# EAGLE design fz10_pow (EAGLE 6.3)
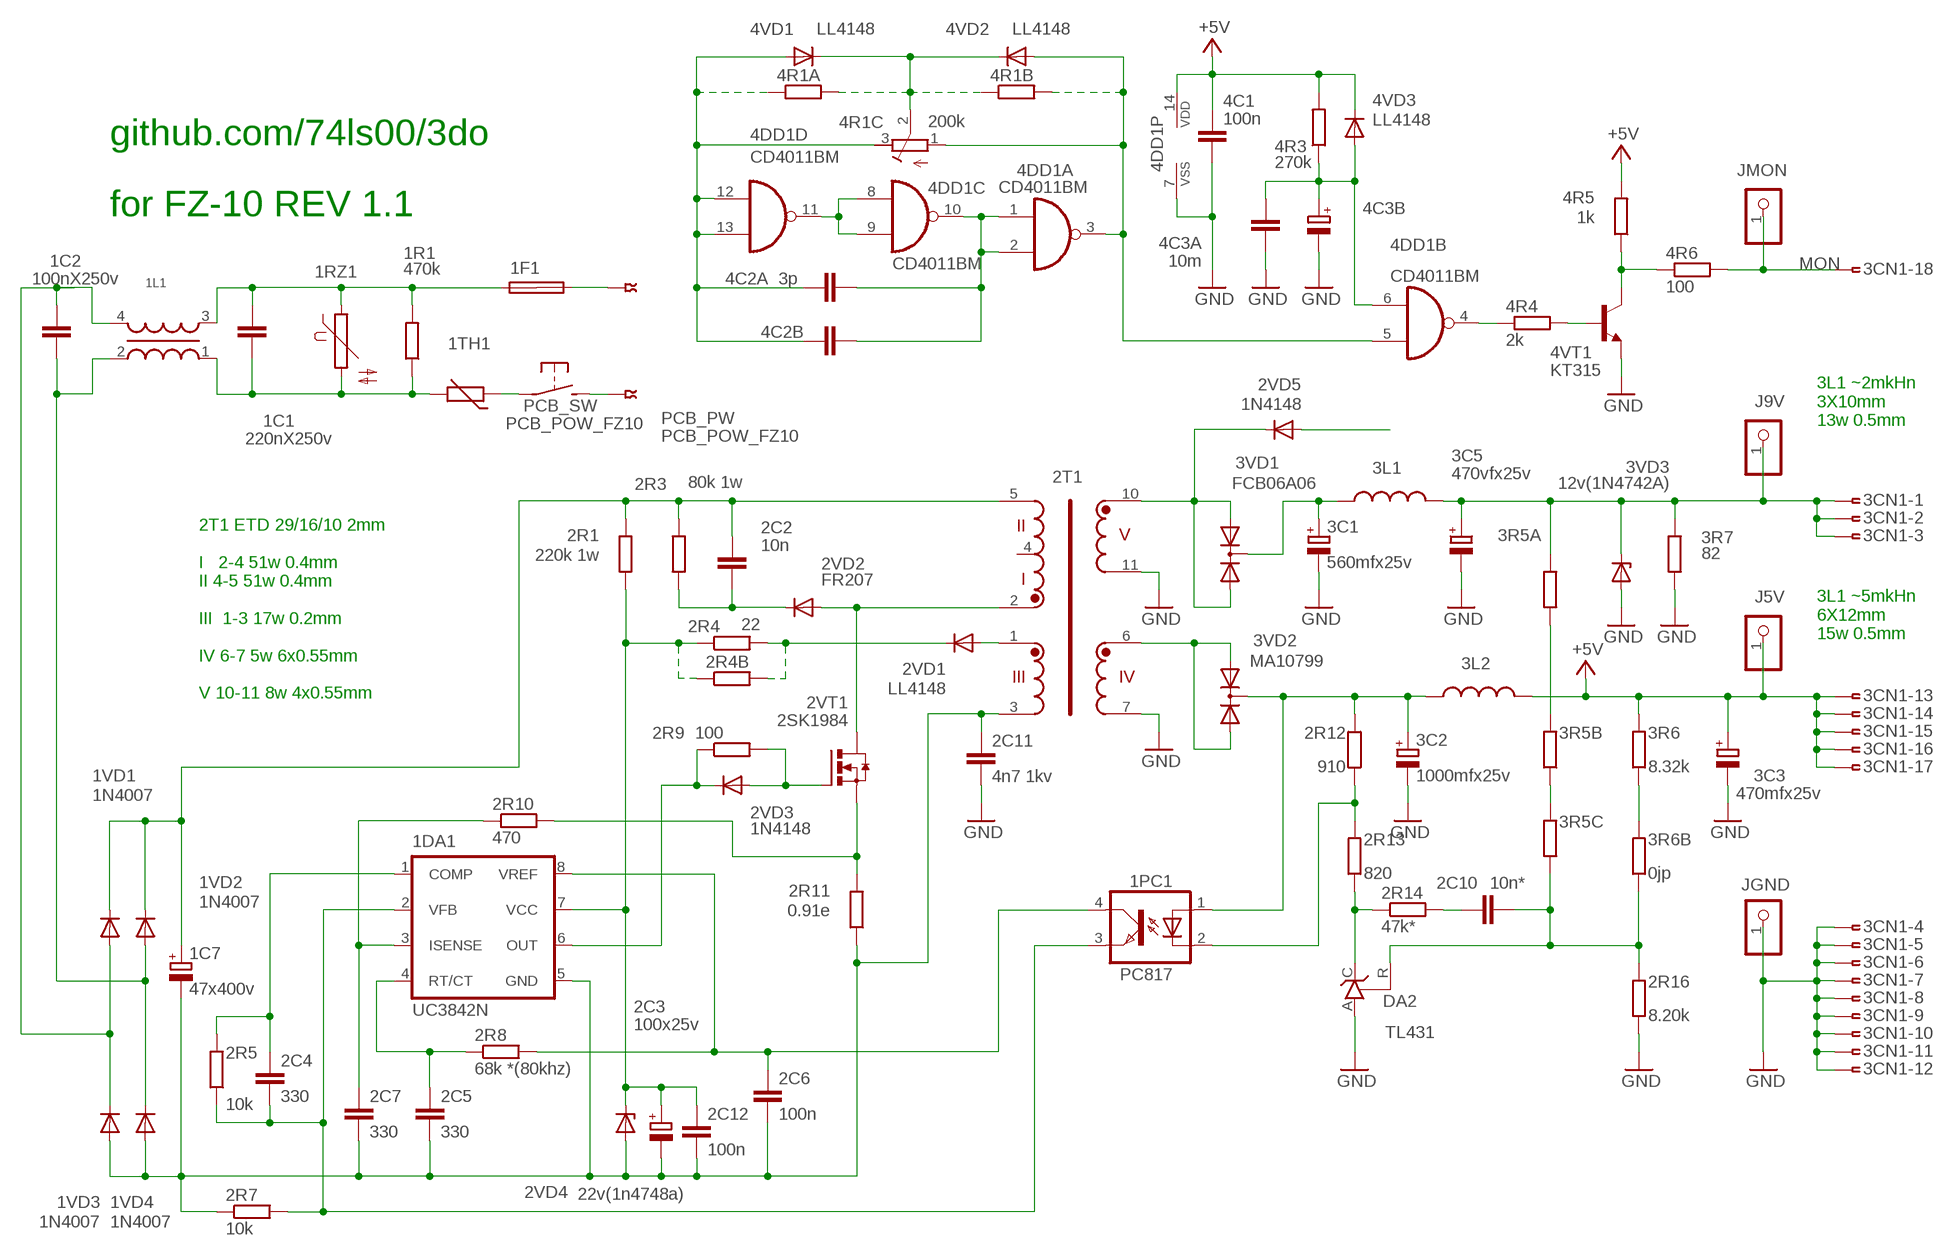
[diagram p0: schematic, sheet 1]

## Parts
1C1  220nX250v  C26X9  [C_26X9]
1C2  100nX250v  C-EU150-084X183  [C150-084X183]
1C7  47x400v  CPOL-EUE10-22.5  [EB22,5D]
1DA1  UC3842N  [DIL08]
1F1  SHK20L  [SHK20L]
1L1  LFLF-10X13  [LF-10X13]
1PC1  PC817  [DIL04]
1R1  470k  R-EU_0309/12  [0309/12]
1RZ1  S1210  [S1210]
1TH1  THERMISTOR-7,5  [R-7,5]
1VD1  1N4007  1N4004  [DO41-10]
1VD2  1N4007  1N4004  [DO41-10]
1VD3  1N4007  1N4004  [DO41-10]
1VD4  1N4007  1N4004  [DO41-10]
2C2  10n  C-EU075-032X103  [C075-032X103]
2C3  100x25v  CPOL-EUE2.5-6  [E2,5-6]
2C4  330  C-EU050-025X075  [C050-025X075]
2C5  330  C-EU050-025X075  [C050-025X075]
2C6  100n  C-EUC0805  [C0805]
2C7  330  C-EU050-025X075  [C050-025X075]
2C10  10n*  C-EU050-025X075  [C050-025X075]
2C11  4n7 1kv  C-EU075-032X103  [C075-032X103]
2C12  100n  C-EUC0805  [C0805]
2R1  220k 1w  R-EU_0613/15  [P0613/15]
2R3  80k 1w  R-EU_0613/15  [P0613/15]
2R4  22  R-EU_M0805  [M0805]
2R4B  R-EU_0207/10  [0207/10]
2R5  10k  R-EU_M0805  [M0805]
2R7  10k  R-EU_R0805  [R0805]
2R8  68k *(80khz)  R-EU_R0805  [R0805]
2R9  100  R-EU_0204/7  [0204/7]
2R10  470  R-EU_0207/10  [0207/10]
2R11  0.91e  R-EU_0613/15  [P0613/15]
2R12  910  R-EU_R1206  [R1206]
2R13  820  R-EU_0207/10  [0207/10]
2R14  47k*  R-EU_R1206  [R1206]
2R16  8.20k  R-EU_R1206  [R1206]
2T1  TRANS_ER29  [ER29]
2VD1  LL4148  DIODE-SOD80C  [SOD80C]
2VD2  FR207  1N4148DO35-10  [DO35-10]
2VD3  1N4148  1N4148DO35-7  [DO35-7]
2VD4  22v(1n4748a)  ZENER-DIODEDO35Z10  [DO35Z10]
2VD5  1N4148  1N4148DO35-7  [DO35-7]
2VT1  2SK1984  IRF3704L-V  [TO262-V]
3C1  560mfx25v  CPOL-EUE5-10.5  [E5-10,5]
3C2  1000mfx25v  CPOL-EUE5-13  [E5-13]
3C3  470mfx25v  CPOL-EUE5-8.5  [E5-8,5]
3C5  470vfx25v  CPOL-EUE5-8.5  [E5-8,5]
3CN1  FTOP-18  [FTOP-18]
3L1  L-USTFI0305  [TFI0305]
3L2  L-USTFI0305  [TFI0305]
3R5A  R-EU_M1206  [M1206]
3R5B  R-EU_M1206  [M1206]
3R5C  R-EU_0207/10  [0207/10]
3R6  8.32k  R-EU_0204/7  [0204/7]
3R6B  0jp  R-EU_0204/7  [0204/7]
3R7  82  R-EU_0613/15  [P0613/15]
3VD1  FCB06A06  BYV32  [TO220ABS]
3VD2  MA10799  BYV32  [TO220ABS]
3VD3  12v(1N4742A)  ZENER-DIODEDO34-7  [DO34Z7]
4C1  100n  C-EUC0805  [C0805]
4C2A  3p  C-EU050-025X075  [C050-025X075]
4C2B  C-EUC1206  [C1206]
4C3A  10m  C-EUC1812  [C1812]
4C3B  CPOL-EUE2.5-5  [E2,5-5]
4DD1  CD4011BM  4011D  [SO14]
4R1A  R-EU_R1206  [R1206]
4R1B  R-EU_R1206  [R1206]
4R1C  200k  R-TRIMM3296W  [RTRIM3296W]
4R3  270k  R-EU_R1206  [R1206]
4R4  2k  R-EU_R1206  [R1206]
4R5  1k  R-EU_R1206  [R1206]
4R6  100  R-EU_R1206  [R1206]
4VD1  LL4148  DIODE-SOD80C  [SOD80C]
4VD2  LL4148  DIODE-SOD80C  [SOD80C]
4VD3  LL4148  DIODE-SOD80C  [SOD80C]
4VT1  KT315  -NPN-TO92-ECB  [TO92-ECB]
DA2  TL431  TL431CLP  [TO92-CLP]
J5V  PINHD-1X1  [1X01]
J9V  PINHD-1X1  [1X01]
JGND  PINHD-1X1  [1X01]
JMON  PINHD-1X1  [1X01]
PCB  PCB_POW_FZ10  [POW_FZ10]

## Nets
+5V: 3C3.+ 3CN1.13 3CN1.14 3CN1.15 3CN1.16 3CN1.17 3L2.2 3R6.2 4C1.1 4DD1.14(P:VDD) 4R3.2 4R5.2 4VD3.C J5V.1
+16IN: 1DA1.7(VCC) 2C3.+ 2C12.1 2R1.1 2R4.1 2R4B.1 2VD4.C
-IN: 1C7.- 1DA1.5(GND) 1VD3.A 1VD4.A 2C3.- 2C5.2 2C6.2 2C7.2 2C11.1 2C12.2 2R7.1 2R11.1 2T1.3(OP2) 2VD4.A
GND: 2C11.2 2R16.1 2T1.7(O2.2) 2T1.11(9V2) 3C1.- 3C2.- 3C3.- 3C5.- 3CN1.4 3CN1.5 3CN1.6 3CN1.7 3CN1.8 3CN1.9 3CN1.10 3CN1.11 3CN1.12 3R7.1 3VD3.A 4C1.2 4C3A.2 4C3B.- 4DD1.7(P:VSS) 4VT1.E DA2.A JGND.1
MON: 3CN1.18 4R6.2 JMON.1
N$1: 4C2A.2 4C2B.2 4DD1.12(D:I0) 4DD1.13(D:I1) 4R1A.1 4R1C.3(E) 4VD1.A
N$2: 4DD1.8(C:I0) 4DD1.9(C:I1) 4DD1.11(D:O)
N$3: 1DA1.4(RT/CT) 2C5.1 2R8.1
N$4: 1DA1.3(ISENSE) 2C7.1 2R10.1
N$5: 2T1.10(9V1) 2VD5.C 3VD1.A1 3VD1.A2
N$6: 1DA1.1(COMP) 2C4.1 2R5.2
N$7: 4DD1.3(A:O) 4DD1.5(B:I0) 4R1B.2 4R1C.1(A) 4VD2.A
N$8: 1DA1.6(OUT) 2R9.1 2VD3.C
N$9: 1TH1.1 PCB.SW1(_SW:P)
N$10: 4R1A.2 4R1B.1 4R1C.2(S) 4VD1.C 4VD2.C
N$11: 2R9.2 2VD3.A 2VT1.1(G)
N$12: 1PC1.2(C) 2R12.1 2R13.2
N$13: 1PC1.1(A) 2R12.2 3C2.+ 3L2.1 3VD2.C
N$14: 2R13.1 2R14.1 DA2.C
N$15: 1C2.1 1L1.4 1VD1.A 1VD3.C
N$16: 2C10.2 2R14.2
N$17: 2T1.2(IN2) 2VD2.A 2VT1.2(D)
N$18: 1F1.1A PCB.POW2
N$19: 4C2A.1 4C2B.1 4DD1.1(A:I0) 4DD1.2(A:I1) 4DD1.10(C:O)
N$20: 1DA1.8(VREF) 1PC1.4(COL) 2C6.1 2R8.2
N$21: 2R10.2 2R11.2 2VT1.3(S)
N$22: 2R4.2 2R4B.2 2VD1.C
N$23: 1C7.+ 1VD1.C 1VD2.C 2C2.1 2R1.2 2R3.2 2T1.5(IN1)
N$24: 2T1.1(OP1) 2VD1.A
N$25: 4DD1.4(B:O) 4R4.1
N$26: 4R4.2 4VT1.B
N$27: 3R5A.1 3R5B.2
N$28: 2T1.6(O2.1) 3VD2.A1 3VD2.A2
N$29: 4R5.1 4R6.1 4VT1.C
N$30: 2C2.2 2R3.1 2VD2.C
N$32: 1C1.2 1L1.1 1R1.1 1RZ1.2 1TH1.2
N$33: 1C1.1 1F1.2A 1L1.3 1R1.2 1RZ1.1
N$34: PCB.POW1 PCB.SW2(_SW:S)
N$35: 4C3A.1 4C3B.+ 4DD1.6(B:I1) 4R3.1 4VD3.A
N$38: 3C5.+ 3CN1.1 3CN1.2 3CN1.3 3L1.2 3R5A.2 3R7.2 3VD3.C J9V.1
N$39: 3C1.+ 3L1.1 3VD1.C
N$40: 1DA1.2(VFB) 1PC1.3(EMIT) 2C4.2 2R5.1 2R7.2
N$41: 3R5B.1 3R5C.2
N$42: 2C10.1 2R16.2 3R5C.1 3R6B.1 DA2.R
N$43: 3R6.1 3R6B.2
N$44: 1C2.2 1L1.2 1VD2.A 1VD4.C
N$45: 2VD5.A
Unconnected: 1F1.1B 1F1.2B 2T1.4(INC)

## Notes on the sheet
- github.com/74ls00/3do
- for FZ-10 REV 1.1
- 3L1 ~2mkHn
  3X10mm
  13w 0.5mm
- 2T1 ETD 29/16/10 2mm
  
  I   2-4 51w 0.4mm
  II 4-5 51w 0.4mm
  
  III  1-3 17w 0.2mm
  
  IV 6-7 5w 6x0.55mm
  
  V 10-11 8w 4x0.55mm
- 3L1 ~5mkHn
  6X12mm
  15w 0.5mm

## Library data of the parts
1C1 = 3do:C
1C2 2C2 2C4-2C7 2C10-2C12 4C1 4C2A 4C2B 4C3A = rcl:C-EU: CAPACITOR, European symbol
1C7 2C3 3C1-3C3 3C5 4C3B = rcl:CPOL-EU: POLARIZED CAPACITOR, European symbol
1DA1 = v-reg:UC384*: SMPS Controller Source: http://www.fairchildsemi.com/ds/UC/UC3843.pdf
1F1 = fuse:SHK20L: FUSE HOLDER 5 x 20 mm, SH contact, SHH1 Schukat, E1073 Buerklin; OC_FARNELL: unknown; OC_NEWARK: unknown
1L1 = DSS0:LF
1PC1 = optocoupler:PC817: SHARP OPTO COUPLER; MPN: PC817X4J000F; OC_FARNELL: 9707727; OC_NEWARK: 97K7059
1R1 2R1 2R3 2R4 2R4B 2R5 2R7-2R14 2R16 3R5A 3R5B 3R5C 3R6 3R6B 3R7 4R1A 4R1B 4R3-4R6 = rcl:R-EU_: RESISTOR, European symbol
1RZ1 = varistor:S1210: VARISTOR
1TH1 = varistor:THERMISTOR: THERMISTOR
1VD1-1VD4 = diode:1N4004: DIODE general purpose rectifier, 1 A
2T1 = 3do:TRANS_ER29
2VD1 4VD1-4VD3 = diode:DIODE-: DIODE
2VD2 2VD3 2VD5 = diode:1N4148: DIODE high speed (Philips)
2VD4 3VD3 = diode:ZENER-DIODE: Z-Diode
2VT1 = transistor-power:IRF3704: SMPS MOSFET HEXFET® Power MOSFET Source: http://www.irf.com/product-info/datasheets/data/irf3704.pdf
3CN1 = 3do:FTOP-18: AMP connector
3L1 3L2 = rcl:L-US: INDUCTOR, American symbol
3VD1 3VD2 = diode:BYV32: DIODE 2 x Si diode 200 V, 20 A/230 Apeak, 25 ns
4DD1 = 40xx:4011: Quad 2-input NAND
4R1C = rcl:R-TRIMM: Trimm resistor
4VT1 = transistor:*-NPN-: NPN Transistror BF959 corrected 2008.03.06
DA2 = v-reg:TL431CLP: VOLTAGE REGULATOR
J5V J9V JGND JMON = pinhead:PINHD-1X1: PIN HEADER
PCB = 3do:PCB_POW_FZ10

## Board
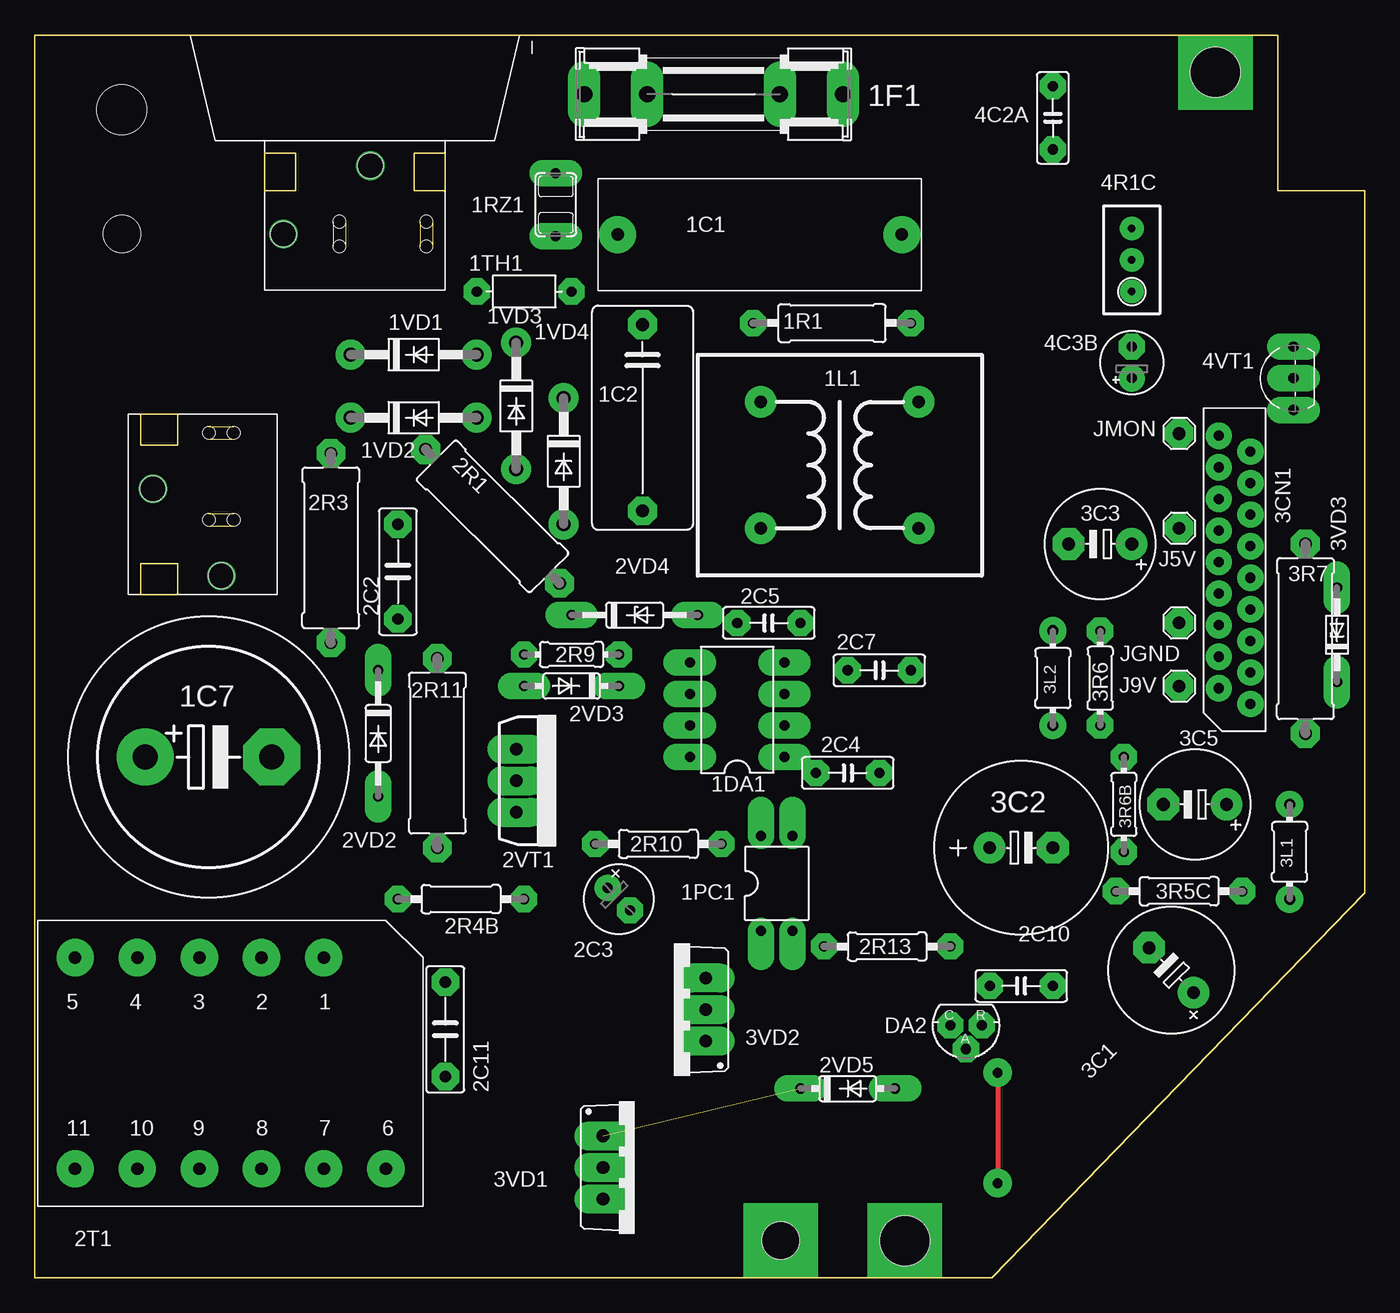
[diagram p1: board, top side]
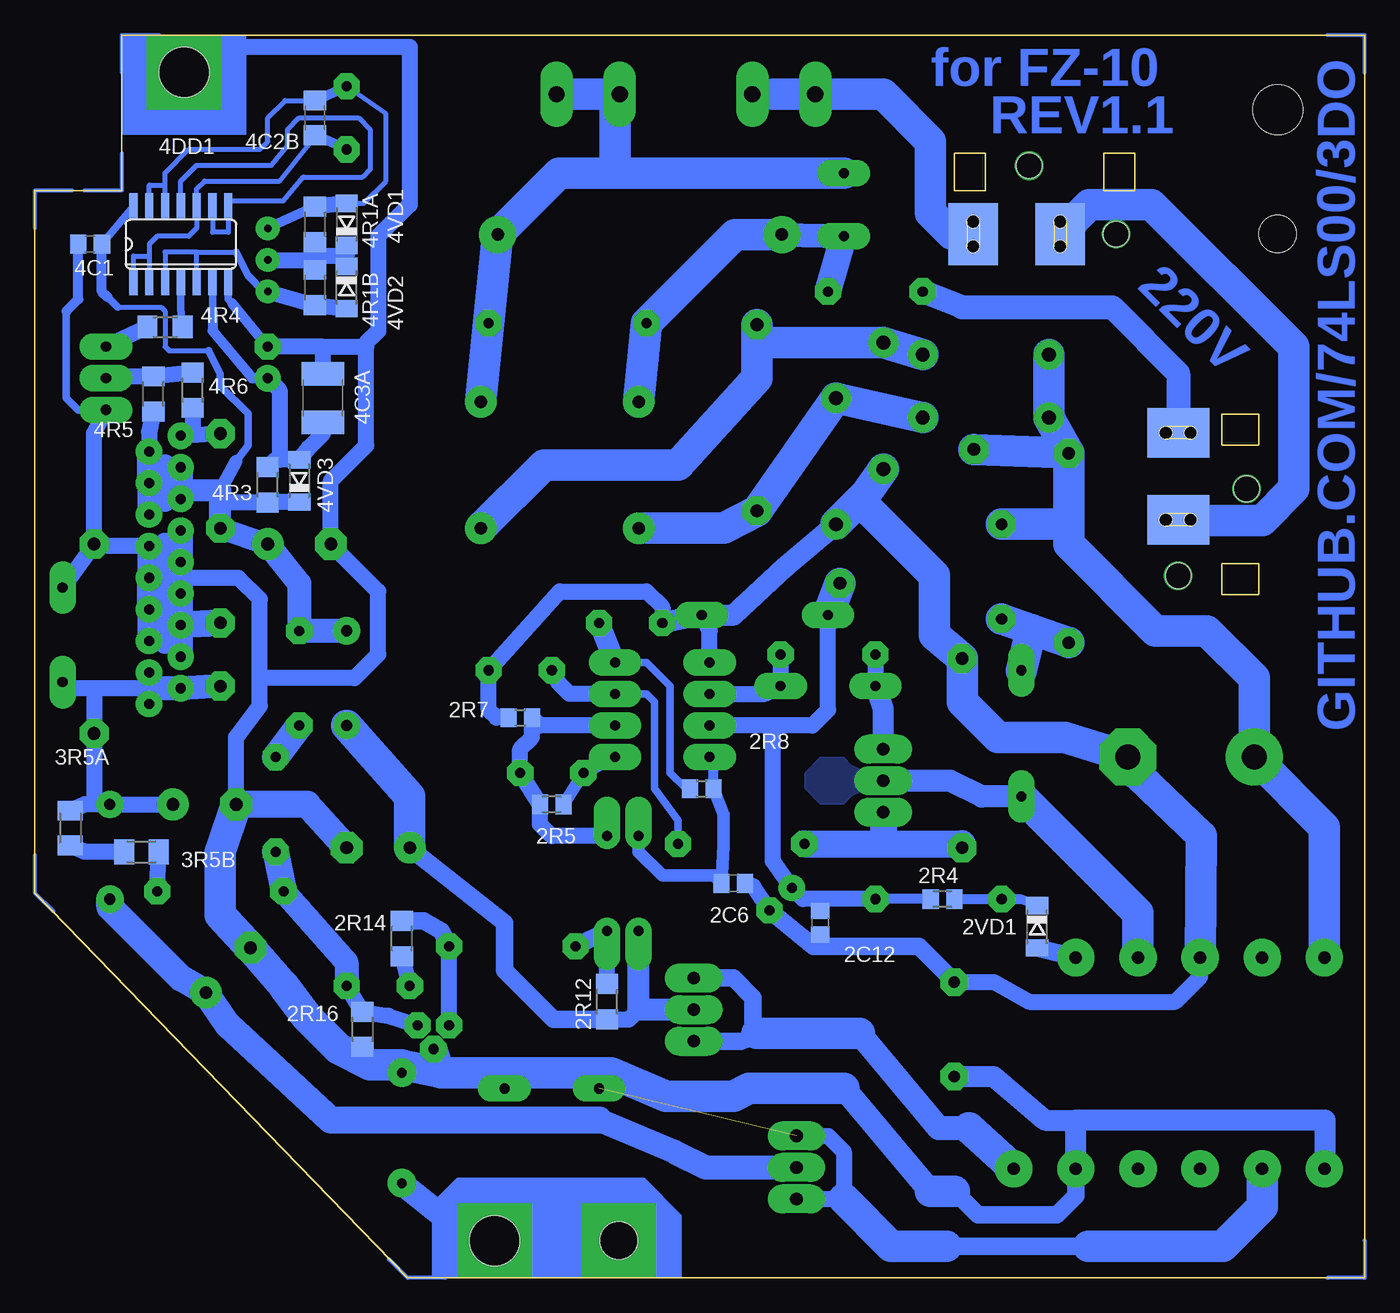
[diagram p2: board, bottom side, seen from below]

Size 107 x 100 mm. Coordinates in mm from the lower left corner, seen from the top.
Copper layers (1*16): Top 0.035mm / dielectric 1.5mm / Bottom 0.035mm
Design rules "DesignRules": minimum track width 8mil, minimum drill 24mil, track to track 0.2mm, track to pad 0.2mm, pad to pad 8mil, via to via 8mil, smd to smd 8mil, copper to edge 10mil, drill to drill 8mil, minimum pad ring 0.65mm, minimum via ring 8mil, stop-mask expansion 4mil, vias tented up to drill 0mil, thermal gap 10mil

### Footprints (pad centres in the part's own frame; a part is rotated, then mirrored left to right if it is on the bottom)
C_26X9 = drill 1 pad 3: 1 -9.438,0.5; 2 13.438,0.5
C150-084X183 = drill 1.016 octagon: 1 -7.493,0; 2 7.493,0
EB22,5D = drill 2.007 pad 4.597: + -5.08,0 | drill 2.007 pad 4.597 octagon: - 5.08,0
DIL08 = drill 0.813 long: 1 -3.81,-3.81; 2 -1.27,-3.81; 3 1.27,-3.81; 4 3.81,-3.81; 5 3.81,3.81; 6 1.27,3.81; 7 -1.27,3.81; 8 -3.81,3.81
SHK20L = drill 1.321 pad 2.54 long: 1A -10.414,0; 1B -5.334,0; 2A 10.414,0; 2B 5.334,0
LF-10X13 = drill 1 pad 2.54: 1 -6.35,5.08; 2 -6.35,-5.08; 3 6.35,5.08; 4 6.35,-5.08
DIL04 = drill 0.813 offset: 1 -1.27,-3.81; 2 1.27,-3.81; 3 1.27,3.81; 4 -1.27,3.81
0309/12 = drill 0.813 octagon: 1 -6.35,0; 2 6.35,0
S1210 = drill 0.813 long: 1 -2.54,0; 2 2.54,0
R-7,5 = drill 0.813 octagon: 1 -3.81,0; 2 3.81,0
DO41-10 = drill 1.118: A 5.08,0; C -5.08,0
C075-032X103 = drill 0.914 octagon: 1 -3.81,0; 2 3.81,0
E2,5-6 = drill 0.813 pad 1.6: + -1.27,0 | drill 0.813 pad 1.6 octagon: - 1.27,0
C050-025X075 = drill 0.813 octagon: 1 -2.54,0; 2 2.54,0
C0805 = smd 1.3 x 1.5: 1 -0.95,0; 2 0.95,0
P0613/15 = drill 1.016 octagon: 1 -7.62,0; 2 7.62,0
M0805 = smd 1.3 x 1.6: 1 -0.95,0; 2 0.95,0
0207/10 = drill 0.813 octagon: 1 -5.08,0; 2 5.08,0
R0805 = smd 1.3 x 1.5: 1 -0.95,0; 2 0.95,0
0204/7 = drill 0.813 octagon: 1 -3.81,0; 2 3.81,0
R1206 = smd 1.6 x 1.803: 1 -1.422,0; 2 1.422,0
ER29 = drill 1 pad 3: 1 -8,8; 2 -8,3; 3 -8,-2; 4 -8,-7; 5 -8,-12; 6 9,13; 7 9,8; 8 9,3; 9 9,-2; 10 9,-7; 11 9,-12
SOD80C = smd 1.4 x 1.8: A 1.7,0; C -1.7,0
DO35-10 = drill 0.813 long: A 5.08,0; C -5.08,0
DO35-7 = drill 0.813 long: A 3.81,0; C -3.81,0
DO35Z10 = drill 0.813 long: A 5.08,0; C -5.08,0
TO262-V = drill 1.016 long: 1 -2.54,0; 2 0,0; 3 2.54,0
E5-10,5 = drill 1.016 pad 2.54: + -2.54,0 | drill 1.016 pad 2.54 octagon: - 2.54,0
E5-13 = drill 1.016 pad 2.54: + -2.54,0 | drill 1.016 pad 2.54 octagon: - 2.54,0
E5-8,5 = drill 1.016 pad 2.54: + -2.54,0 | drill 1.016 pad 2.54 octagon: - 2.54,0
FTOP-18 = drill 0.813: 1 -10.795,-1.27; 2 -9.525,1.27; 3 -8.255,-1.27; 4 -6.985,1.27; 5 -5.715,-1.27; 6 -4.445,1.27; 7 -3.175,-1.27; 8 -1.905,1.27; 9 -0.635,-1.27; 10 0.635,1.27; 11 1.905,-1.27; 12 3.175,1.27; 13 4.445,-1.27; 14 5.715,1.27; 15 6.985,-1.27; 16 8.255,1.27; 17 9.525,-1.27; 18 10.795,1.27
TFI0305 = drill 0.9 pad 1.5: 1 -3.81,0; 2 3.81,0
M1206 = smd 1.6 x 2: 1 -1.4,0; 2 1.4,0
TO220ABS = drill 1.016 long: A1 -2.54,-2.54; A2 2.54,-2.54; C 0,-2.54
DO34Z7 = drill 0.813 long: A 3.81,0; C -3.81,0
C1206 = smd 1.6 x 1.8: 1 -1.4,0; 2 1.4,0
C1812 = smd 1.9 x 3.4: 1 -1.95,0; 2 1.95,0
E2,5-5 = drill 0.813 pad 1.6: + -1.27,0 | drill 0.813 pad 1.6 octagon: - 1.27,0
SO14 = smd 0.66 x 2.032: 1 -3.81,-3.073; 2 -2.54,-3.073; 3 -1.27,-3.073; 4 0,-3.073; 5 1.27,-3.073; 6 2.54,-3.073; 7 3.81,-3.073; 8 3.81,3.073; 9 2.54,3.073; 10 1.27,3.073; 11 0,3.073; 12 -1.27,3.073; 13 -2.54,3.073; 14 -3.81,3.073
RTRIM3296W = drill 0.61: 1 0,-2.54; 2 0,0; 3 0,2.54
TO92-ECB = drill 0.813 long: B 2.54,0; C 0,0; E -2.54,0
TO92-CLP = drill 0.813 octagon: A 0,1.905; C 1.27,0; R -1.27,0
1X01 = drill 1.016 octagon: 1 0,0
POW_FZ10 = drill 1 pad 6 square: GND1 95,97; GND2 70,3; GND3 60,3 | drill 1 pad 3: P$1 7,84 | drill 1 pad 4: P$2 7,94 | drill 1 pad 2: P$3 20,84; P$4 27,89.5; P$5 9.5,63.5; P$6 15,56.5 | smd 4 x 5 bottom: POW1 24.5,84; POW2 31.5,84 | smd 5 x 4 bottom: SW1 15,68; SW2 15,61 | hole 4: 7,94; 95,97; 70,3 | hole 3: 7,84; 60,3 | hole 2: 20,84; 27,89.5; 15,56.5; 9.5,63.5 | hole 1: 24.5,85; 24.5,83; 31.5,85; 31.5,83; 14,68; 16,68; 14,61; 16,61

### Placement (x,y rotation side)
1C1  60.33,84.45 180 top
1C2  48.9,69.22 270 top
1C7  13.97,41.91 0 top
1DA1  56.52,45.72 90 top
1F1  54.61,95.25 0 top
1L1  64.77,65.41 0 top
1PC1  59.69,31.75 0 top
1R1  64.14,76.83 0 top
1RZ1  41.91,86.36 270 top
1TH1  39.37,79.38 0 top
1VD1  30.48,74.3 0 top
1VD2  30.48,69.22 0 top
1VD3  38.73,70.17 270 top
1VD4  42.55,65.72 270 top
2C2  29.21,56.83 270 top
2C3  46.99,30.48 315 top
2C4  65.41,40.64 0 top
2C5  59.05,52.7 180 top
2C6  50.8,31.75 0 bottom
2C7  67.94,48.9 0 top
2C10  79.38,23.5 180 top
2C11  33.02,20 270 top
2C12  43.81,28.57 270 bottom
2R1  36.83,61.28 135 top
2R3  23.81,58.74 90 top
2R4  33.97,30.48 0 bottom
2R4B  34.29,30.48 180 top
2R5  65.41,38.1 0 bottom
2R7  67.94,45.09 0 bottom
2R8  53.34,39.37 0 bottom
2R9  43.18,50.16 180 top
2R10  50.16,34.92 180 top
2R11  32.38,42.23 270 top
2R12  60.96,22.23 270 bottom
2R13  68.58,26.67 180 top
2R14  77.47,27.3 270 bottom
2R16  80.64,20 90 bottom
2T1  15.24,17.78 270 top
2VD1  26.35,28.26 270 bottom
2VD2  27.62,43.81 270 top
2VD3  43.18,47.62 180 top
2VD4  48.26,53.34 0 top
2VD5  65.41,15.24 0 top
2VT1  38.73,40.01 270 top
3C1  91.44,24.77 135 top
3C2  79.38,34.61 0 top
3C3  85.72,59.05 180 top
3C5  93.34,38.1 180 top
3CN1  96.55,56.97 90 top
3L1  100.97,34.29 90 top
3L2  81.92,48.26 90 top
3R5A  104.14,36.2 90 bottom
3R5B  98.42,34.29 180 bottom
3R5C  92.08,31.11 0 top
3R6  85.72,48.26 90 top
3R6B  87.63,38.1 90 top
3R7  102.23,51.44 270 top
3VD1  48.26,8.89 270 top
3VD2  51.44,21.59 90 top
3VD3  104.78,51.75 90 top
4C1  102.55,83.19 180 bottom
4C2A  81.92,93.34 90 top
4C2B  84.45,93.34 90 bottom
4C3A  83.82,70.8 90 bottom
4C3B  88.27,73.66 90 top
4DD1  95.25,83.19 0 bottom
4R1A  84.45,84.77 270 bottom
4R1B  84.45,79.69 270 bottom
4R1C  88.27,81.92 0 top
4R3  88.27,63.82 270 bottom
4R4  96.52,76.52 180 bottom
4R5  97.47,71.12 270 bottom
4R6  94.3,71.44 270 bottom
4VD1  81.92,84.77 90 bottom
4VD2  81.92,79.69 270 bottom
4VD3  85.72,64.14 90 bottom
4VT1  101.28,72.39 90 top
DA2  74.93,20.32 180 top
J5V  92.08,60.33 0 top
J9V  92.08,47.62 0 top
JGND  92.08,52.7 0 top
JMON  92.08,67.94 0 top
PCB  0,0 0 top

### Tracks (layer width: path | path; a pad name or v marks a point on that pad's centre or on a via)
+5V
  Bottom 0.406: 100.33,78.11 96.84,78.11 96.52,77.79 96.52,74.93 96.2,74.61 93.03,74.61
  Bottom 0.61: 4DD1.14 4C1.1 | 101.15,78.93 100.33,78.11 | 93.03,74.61 92.08,72.71 92.08,71.75 89.85,69.53 89.85,66.99 90.81,65.72
  Bottom 0.813: 101.15,78.93 101.6,79.38 4C1.1
  Bottom 1.016: 90.81,65.72 92.08,63.35
  Bottom 1.27: 4R5.2 97.81,68.08 3CN1.17 | 4VD3.C 87.59,62.44 4R3.2 92.08,62.4 92.08,62.87
  Bottom 1.778: 3C3.+ J5V.1 92.08,62.87 92.08,63.35 95.28,63.35 95.28,63.18
  Bottom 1.93: 3CN1.16 95.28,63.96 | 95.28,63.96 3CN1.15 | 3CN1.14 95.28,63.18 95.28,63.96 | 3CN1.15 3CN1.13 | 3CN1.15 3CN1.17 | 3L2.2 3R6.2 85.72,55.88 3C3.+
+16IN
  Bottom 0.61: 2C12.1 43.81,30.48
  Bottom 0.813: 2R4.1 2R4B.1
  Bottom 1.27: 47.62,44.45 44.45,44.45 43.18,45.72 2VD4.C | 47.62,44.45 1DA1.7 | 47.62,44.45 47.62,33.55 2C3.+ 45.19,30.48 43.81,30.48 2R4B.1
  Bottom 2.54: 2R1.1 2VD4.C
-IN
  Bottom 0.61: 2C12.2 43.81,26.67
  Bottom 1.27: 1DA1.5 52.7,52.07 2VD4.A | 2C5.2 56.52,53.98 57.78,55.24 64.77,55.24 2C7.2 70.48,45.72 69.85,45.09 2R7.1 | 2C11.1 29.84,23.81 26.99,22.23 15.24,22.23 13.24,24.23 2T1.3 | 2C3.- 49.22,31.54 2C6.2
  Bottom 1.422: 2C11.1 35.88,26.67 43.81,26.67 44.34,26.67 2C3.-
  Bottom 1.676: 2C5.2 2VD4.A 50.8,53.34 46.67,57.15 1VD4.A
  Bottom 2.54: 2T1.3 13.16,35.56 18.24,40.47 1C7.- 24.13,43.5 29.53,43.5 32.38,46.35 2R11.1 34.61,51.75 34.61,56.52 40.16,62.07 40.16,63.02 | 1VD4.A 40.16,63.02 | 40.16,63.02 1VD3.A
GND  (via drill 0.8 pad 2.3)
  Top 0.406: v77.47,16.51 v77.47,7.62
  Bottom 0.61: 4DD1.7 91.44,78.74 91.12,78.42 | 4VT1.E 103.5,69.85 104.46,70.8 104.46,77.79
  Bottom 0.813: 2R16.1 80.01,17.14 | 4C3B.- 91.12,78.42 | 104.46,77.79 103.5,78.74 4C1.2
  Bottom 1.27: 2T1.11 3.17,8.85 | 3R7.1 3VD3.A | 3C5.- 90.81,43.5 88.9,46.04 88.9,48.26 | 88.9,48.26 88.9,54.61 90.63,56.34 95.28,56.34 | 88.9,48.26 81.28,48.26 79.38,50.16 79.38,55.24 3C3.- 83.19,64.14 80.33,66.99 80.33,74.93 | 3R7.1 102.23,67.94 4VT1.E | 90.81,99.06 76.83,99.06 76.83,86.36 79.38,83.82 79.38,76.2 80.33,75.25 80.33,74.93 | 4C3A.2 83.82,74.93 | 83.82,74.93 4C3B.- | 83.82,74.93 80.33,74.93 | 3CN1.11 102.23,58.88 3R7.1
  Bottom 1.422: 33.02,6.99 31.11,5.08 24.77,5.08 23.24,6.61 2T1.7
  Bottom 1.676: 3.17,8.85 3.17,12.7 23.24,12.7 | 2T1.7 23.24,12.7 | 23.24,12.7 25.72,12.7 29.84,16.19 2C11.2
  Bottom 1.93: 3CN1.12 3CN1.10 95.28,56.34 | 95.28,56.34 3CN1.8 3CN1.6 3CN1.4 | 3CN1.9 95.28,56.34 | 3CN1.9 3CN1.7 3CN1.5 | 3CN1.11 3CN1.9 | v77.47,16.51 77.47,17.14 | v77.47,7.62 74.3,5.08 | 41.91,15.24 34.92,6.99
  Bottom 2.184: DA2.A 74.3,16.51 | 3C2.- 85.09,38.1 3C5.- | JGND.1 3CN1.6
  Bottom 2.54: 41.91,15.24 49.53,15.24 50.8,14.61 56.2,14.61 60.64,16.51 74.3,16.51 77.47,17.14 80.01,17.14 82.55,18.41 85.09,20.95 87,23.5 3C1.- 92.08,29.21 92.08,34.29 3C5.- | 34.92,6.99 33.02,6.99
MON
  Bottom 1.27: 93.97,67.84 JMON.1 91.92,68.1 | 93.97,67.84 3CN1.18 | 4R6.2 94.3,68.16 93.97,67.84
N$1
  Bottom 0.406: 4DD1.13 97.79,87.95 96.52,87.95 | 4DD1.12 96.52,87.95 | 96.52,87.95 96.52,88.9 94.61,90.81 88.9,90.81 88.27,91.44 88.27,93.34 86.86,94.75 4C2B.2 | 4VD1.A 80.53,86.47 78.74,88.27 78.74,93.66 4C2A.2
  Bottom 0.813: 4R1A.1 4R1C.3 | 4C2B.2 4C2A.2
  Bottom 1.27: 4VD1.A 4R1A.1
N$2
  Bottom 0.406: 4DD1.8 91.44,84.14 92.71,84.14 4DD1.9 | 91.34,86.36 4DD1.8 | 4DD1.11 95.25,88.27 93.98,89.53 87.95,89.53 86.68,91.12 86.68,92.39 85.72,93.34 80.96,93.34 80.01,92.39 80.01,89.22 80.64,88.58 85.41,88.58 87,86.68 91.12,86.68 91.54,86.26 4DD1.8
N$3
  Bottom 0.61: 1DA1.4 57.78,49.53 55.88,47.62 55.88,40.64 54.61,39.37 2R8.1
  Bottom 1.676: 1DA1.4 2C5.1
N$4
  Bottom 0.61: 1DA1.3 57.78,46.99 57.15,46.35 57.15,39.37 55.24,36.83 2R10.1
  Bottom 1.27: 1DA1.3 63.98,46.99 64.77,47.78 2C7.1
N$5  (1 unrouted)
  Bottom 1.27: 3VD1.A2 41.91,6.35 41.91,10.16 43.18,11.43 3VD1.A1
  Bottom 1.422: 33.66,2.54 22.23,2.54
  Bottom 2.54: 33.66,2.54 38.1,2.54 41.91,6.35 | 22.23,2.54 11.43,2.54 8.26,5.71 8.26,8.77 2T1.10
N$6
  Bottom 1.016: 2R5.2 2C4.1 1DA1.1
N$7
  Bottom 0.406: 4DD1.5 93.98,82.55 | 93.98,82.55 96.52,82.55 4DD1.3 | 93.98,82.55 90.81,82.55
  Bottom 0.61: 4R1C.1 88.58,79.38 89.85,80.64 90.81,82.55
  Bottom 1.27: 4R1C.1 4R1B.2 4VD2.A
N$8
  Bottom 1.27: 2R9.1 2VD3.C 48.26,46.99 1DA1.6
N$9
  Bottom 1.93: PCB.SW1 15,72.78 20.32,78.11 32.38,78.11 1TH1.1
N$10
  Bottom 1.27: 4VD1.C 81.92,82.23 | 81.92,82.23 84.45,82.23 | 84.45,81.92 4R1B.1 | 4VD2.C 81.92,82.23 | 84.45,82.23 4R1A.2 | 4R1C.2 84.45,81.92 | 84.45,81.92 84.45,82.23
N$11
  Bottom 1.27: 2R9.2 2VD3.A
  Bottom 1.676: 2VT1.1 38.73,45.72 2VD3.A
N$12
  Bottom 1.27: 2R12.1 1PC1.2
  Bottom 1.422: 2R13.2 1PC1.2
N$13
  Bottom 1.27: 2R12.2 59.21,20.8 58.42,21.59
  Bottom 1.422: 2R12.2 65.25,20.8 69.22,24.77 69.22,28.57 3C2.+
  Bottom 1.778: 3VD2.C 58.42,21.59 1PC1.1
  Bottom 2.54: 3C2.+ 76.83,38.73 3L2.1
N$14
  Bottom 1.27: DA2.C 2R13.1
  Bottom 1.422: 2R14.1 75.72,28.73 74.3,27.94 2R13.1
N$15
  Bottom 2.54: 1L1.4 66.04,65.41 55.24,65.41 48.9,72.39 48.9,74.93 | 48.9,74.93 1C2.1 | 48.9,74.93 47.94,75.25 1VD3.C 1VD1.A
N$16
  Bottom 1.27: 2R14.2 2C10.2
N$17
  Bottom 1.778: 2VD2.A 30.8,38.73 33.34,40.01 2VT1.2
  Bottom 2.54: 2T1.2 18.24,29.35 2VD2.A
  pour Bottom (no thermals): 40.01,40.64 41.27,41.27 41.91,41.91 43.81,41.91 45.09,40.64 45.09,39.37 43.81,38.1 41.91,38.1 41.27,38.73 40.01,39.37
N$18
  Bottom 2.54: PCB.POW2 33.2,84 34.92,85.72 34.92,91.44 38.73,95.25 1F1.1A | 1F1.1A 47.62,95.25 | 1F1.1A 42.55,95.25
N$19
  Bottom 0.406: 4DD1.1 99.06,82.23 97.79,82.23 | 97.79,82.23 4DD1.2 | 97.79,82.23 97.79,83.19 97.16,83.82 94.61,83.82 93.98,84.45 4DD1.10 93.98,87.63 93.34,88.27 87.31,88.27 84.77,91.44 4C2B.1
  Bottom 0.813: 4C2A.1 4C2B.1
N$20
  Bottom 0.813: 2R8.2 52.39,41.59 1DA1.8
  Bottom 1.016: 1PC1.4 58.42,34.29 56.52,32.38 52.38,32.38 2C6.1 51.59,34.77 51.59,37.3 2R8.2
N$21
  Bottom 2.184: 2R10.2 38.73,34.92 | 38.73,34.92 32.38,34.92 2R11.2 | 2VT1.3 38.73,34.92
N$22
  Bottom 0.813: 2VD1.C 27.73,30.48 2R4B.2 2R4.2
N$23
  Bottom 2.54: 2T1.5 3.24,36.26 1C7.+ 8.89,48.26 12.7,52.07 16.83,52.07 23.81,59.05 23.81,60.33 | 2R3.2 1VD2.C 1VD1.C | 2R3.2 23.81,60.33 | 2C2.1 24.13,60.64 23.81,60.33 | 2R1.2 2R3.2
N$24
  Bottom 1.422: 2T1.1 2VD1.A
N$25
  Bottom 0.61: 4DD1.4 95.25,77.94 4R4.1
N$26
  Bottom 1.27: 4VT1.B 4R4.2
N$27
  Bottom 1.27: 3R5B.2 103,34.29 3R5A.1
N$28
  Bottom 1.422: 3VD2.A1 50.16,19.05 49.21,19.37 | 49.21,19.37 48.9,19.68 | 49.21,19.37 49.21,22.54 50.8,24.13 3VD2.A2
  Bottom 1.93: 40.64,19.68 34.29,12.06 31.84,12.06
  Bottom 2.54: 48.9,19.68 40.64,19.68 | 31.84,12.06 2T1.6
N$29
  Bottom 1.27: 4R6.1 4R5.1 99.85,72.54 4VT1.C
N$30
  Bottom 2.54: 2R3.1 26.84,52.18 | 26.84,52.18 2C2.2 | 2VD2.C 26.84,52.18
N$31
  Bottom 1.778: 96.52,59.05 96.52,51.12
N$32
  Bottom 1.93: 1C1.2 1RZ1.2
  Bottom 2.184: 1TH1.2 1RZ1.2
  Bottom 2.54: 1L1.1 1R1.1 50.66,83.95 1C1.2
N$33
  Bottom 2.54: 1L1.3 1R1.2 1C1.1 64.82,88.9 60.33,88.9 | 1RZ1.1 60.33,88.9 | 1F1.2A 60.33,95.25 60.33,88.9
N$34
  Bottom 1.016: 16.51,60.96 15.04,60.96 PCB.SW2
  Bottom 2.54: 15.04,60.96 8.26,60.96 5.71,63.5 5.71,74.93 17.14,86.36 22.14,86.36 PCB.POW1
N$35
  Bottom 0.61: 4DD1.6 92.71,77.79
  Bottom 0.813: 92.71,77.79 92.71,76.2 89.53,72.39 4C3B.+
  Bottom 1.27: 87.31,65.83 4VD3.A 84.98,66.79 83.82,67.94 4C3A.1 | 87.31,65.83 87.63,65.83 4R3.1 | 4C3B.+ 87.31,71.44 87.31,65.83
N$36
  Bottom 1.778: 96.52,65.41 96.52,62.55
N$38
  Bottom 1.27: 3C5.+ 3L1.2 102.23,38.1 | 102.23,38.1 103,38.1 3R5A.2 | 102.23,38.1 3R7.2 102.23,47.45 | 97.81,47.45 102.23,47.45 | 102.23,47.45 104.78,47.45 3VD3.C
  Bottom 1.93: 97.81,47.45 3CN1.2 J9V.1 | 97.81,47.45 3CN1.1 | 3CN1.3 97.81,47.45
N$39
  Bottom 1.93: 3VD1.C 53.02,8.89 55.56,10.16 61.59,12.7
  Bottom 2.184: 61.59,12.7 83.19,12.7 91.44,20.32 3C1.+ 95.25,24.13 100.97,29.84 3L1.1
N$40
  Bottom 1.27: 1PC1.3 65.41,35.56 66.36,36.51 2R5.1 2C4.2 67.94,42.55 67,43.49 2R7.2 66.36,44.45 1DA1.2
N$41
  Bottom 1.27: 3R5C.2 3R5B.1
N$42
  Bottom 1.27: DA2.R 78.58,21.11 2R16.2 2C10.1
  Bottom 1.93: 3R5C.1 81.92,25.4 2C10.1
  Bottom 2.184: 3R6B.1 3R5C.1
N$43
  Bottom 2.184: 3R6.1 3R6B.2
N$44
  Bottom 2.54: 1L1.2 51.56,60.33 1C2.2 1VD4.C 1VD2.A
(copper drawn outside any net)
  shapes: Bottom area x1

### Text on the board
Bottom: GITHUB.COM/74LS00/3DO | for FZ-10 | REV1.1 | 220V